# Altium schematic sheet USB2.0.SchDoc
size A4; SheetNumber: 1; SheetTotal: 26
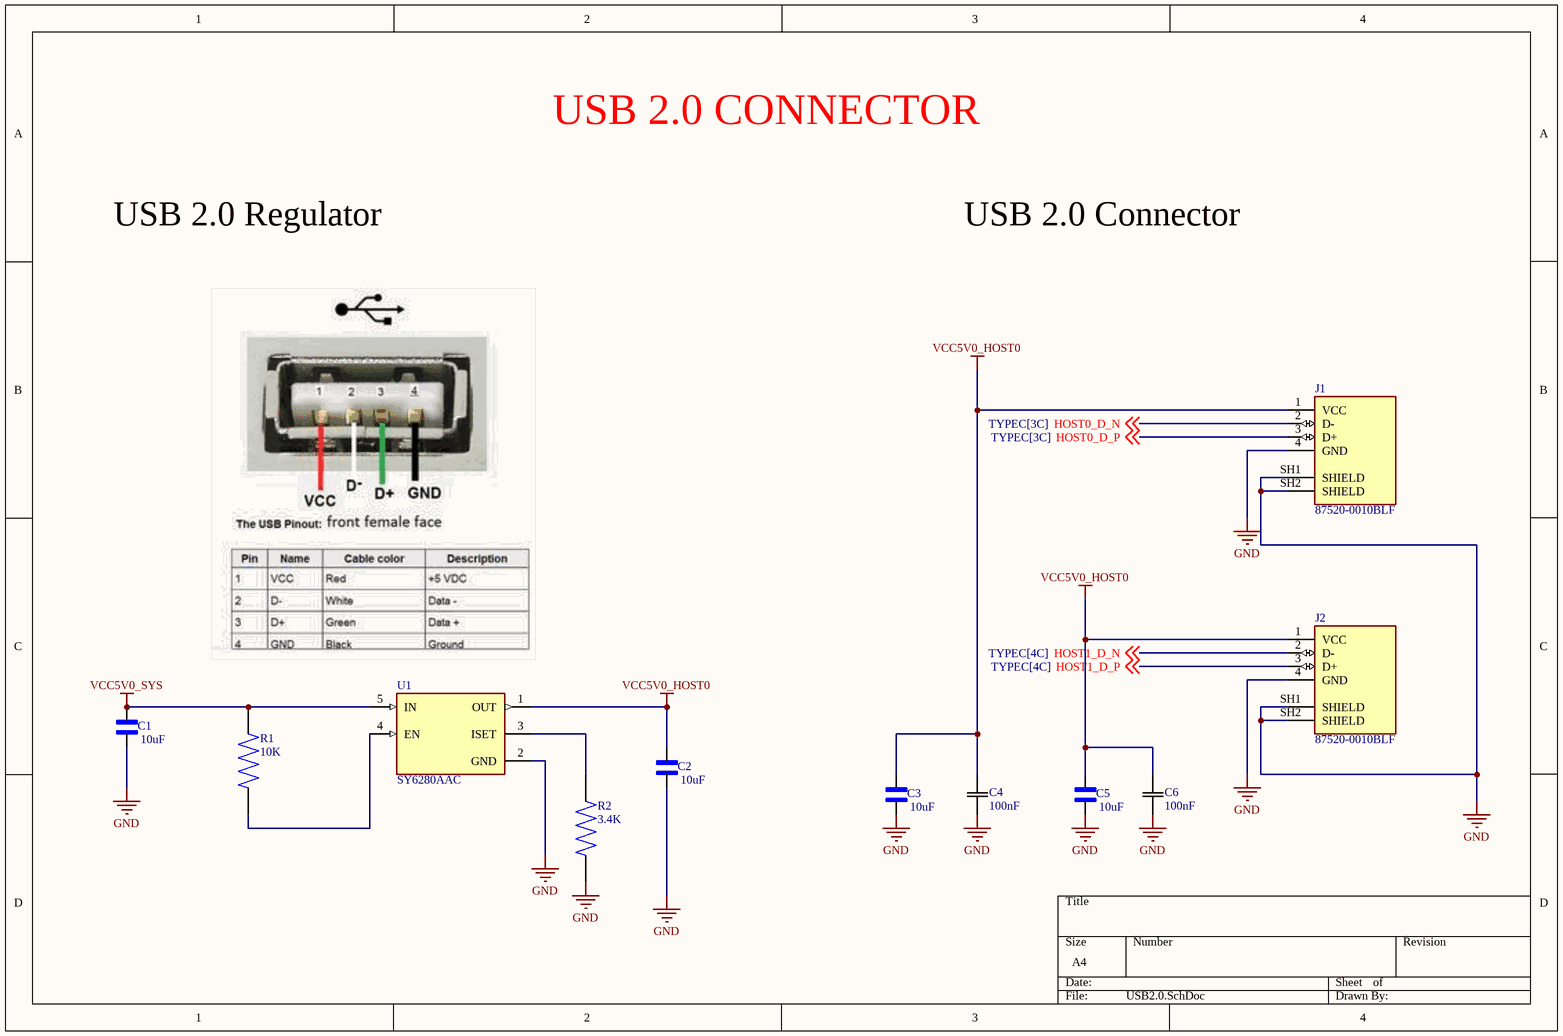
[diagram p0: USB2.0.SchDoc]

## Parts
C1  10uF  [CAPC1005X70N]
C2  10uF  [CAPC1005X70N]
C3  10uF  [CAPC1005X70N]
C4  100nF  [CAP_1005_TDK]
C5  10uF  [CAPC1005X70N]
C6  100nF  [CAP_1005_TDK]
J1  87520-0010BLF  [AMPHENOL_87520-0010BLF]
J2  87520-0010BLF  [AMPHENOL_87520-0010BLF]
R1  10K  [RES_ERA3ARB103V]
R2  3.4K  [RES_ERJPA2F3401X]
U1  SY6280AAC  [SOT95P285X130-5N]

## Nets
GND: C1.1 C2.1 C3.1 C4.2 C5.1 C6.2 J1.4(GND) J1.SH1(SHIELD) J1.SH2(SHIELD) J2.4(GND) J2.SH1(SHIELD) J2.SH2(SHIELD) R2.1 U1.2(GND)
VCC5V0_HOST0: C2.2 C3.2 C4.1 C5.2 C6.1 J1.1(VCC) J2.1(VCC) U1.1(OUT)
VCC5V0_SYS: C1.2 R1.2 U1.5(IN)
HOST0_D_N: J1.2(D-) ; off-sheet HOST0_D_N
HOST0_D_P: J1.3(D+) ; off-sheet HOST0_D_P
HOST1_D_N: J2.2(D-) ; off-sheet HOST1_D_N
HOST1_D_P: J2.3(D+) ; off-sheet HOST1_D_P
NetR1_1: R1.1 U1.4(EN)
NetR2_2: R2.2 U1.3(ISET)

## Notes on the sheet
- USB 2.0 CONNECTOR
- USB 2.0 Regulator
- USB 2.0 Connector

## Library data of the parts
C1-C3 C5 = CL05A106MQ5NUNC: 10 ÂµF Â±20% 6.3V Ceramic Capacitor X5R 0402 (1005 Metric); MF: Samsung; SnapEDA_Link: https://www.snapeda.com/parts/CL05A106MQ5NUNC/Samsung/view-part/?ref=snap; Package: SMD-2 Samsung; Value: *; MP: CL05A106MQ5NUNC; Check_prices: https://www.snapeda.com/parts/CL05A106MQ5NUNC/Samsung/view-part/?ref=eda
C4 C6 = C1005X7R1H104M050BB: Description; Manufacturer_Name: TDK; Copyright: Copyright (C) 2025 Ultra Librarian. All rights reserved.; Manufacturer_Part_Number: C1005X7R1H104M050BB
J1 J2 = 87520-0010BLF: Conn Data USB TypeA Socket 4Cnts RightAngle ThruHole White 1.57mmPCB | Amphenol FCI (Amphenol CS) 87520-0010BLF; MF: AMPHENOL ICC / FCI; SnapEDA_Link: https://www.snapeda.com/parts/87520-0010BLF/Amphenol/view-part/?ref=snap; Package: None; Value: *; MP: 87520-0010BLF; Check_prices: https://www.snapeda.com/parts/87520-0010BLF/Amphenol/view-part/?ref=eda
R1 = ERA3ARB103V: MP: ERA3ARB103V; Availability: Unavailable; Package: None; Value: *; Price: None
R2 = ERJPA2F3401X: Package: None; Price: None; Value: *; MP: ERJPA2F3401X; Availability: Unavailable
U1 = SY6280AAC: USB Power Distribution SW Single 5.5V 1A 5-Pin SOT-23; MF: Silergy; SnapEDA_Link: https://www.snapeda.com/parts/SY6280AAC/Silergy/view-part/?ref=snap; Package: SOT-23-5 Silergy; Value: *; MP: SY6280AAC; Check_prices: https://www.snapeda.com/parts/SY6280AAC/Silergy/view-part/?ref=eda